# Altium project io test.PrjPcb
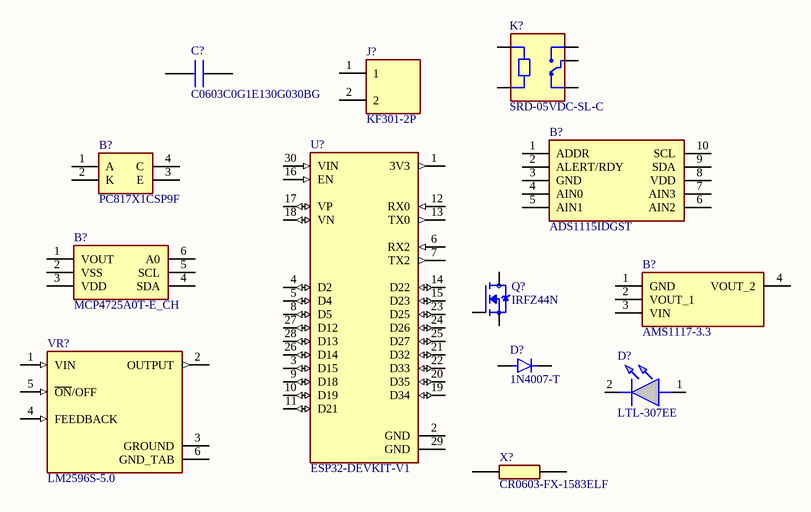
[diagram p0: Sheet1.SchDoc]
1 sheet, 13 parts. Net scope: global (net labels, ports and power ports of the same name join across sheets).
Board file: PCB1.PcbDoc

## Sheet Sheet1.SchDoc
size A3; SheetNumber: 1; SheetTotal: 1

### Parts
(Parts that share a designator on the sheet are numbered #1, #2 ... from top to bottom, then left to right.)
B?#1  ADS1115IDGST  [SOP50P490X110-10N]
B?#2  PC817X1CSP9F  [SOP254P1016X436-4N]
B?#3  MCP4725A0T-E_CH  [SOT95P270X145-6N]
B?#4  AMS1117-3.3  [SOT229P700X180-4N]
C?  C0603C0G1E130G030BG  [CAPC0603X33N]
D?#1  1N4007-T  [DIOAD780W78L463D236]
D?#2  LTL-307EE  [LTL307YE]
J?  KF301-2P  [HANDSON_KF301-2P]
K?  SRD-05VDC-SL-C  [RELAY_SRD-05VDC-SL-C]
Q?  IRFZ44N  [TO254P1016X419X2286-3]
U?  ESP32-DEVKIT-V1  [MODULE_ESP32_DEVKIT_V1]
VR?  LM2596S-5.0  [TO170P1524X483-6N]
X?  CR0603-FX-1583ELF  [RESC1608X55N]

### Nets

Not connected (* = marked no-connect by the designer): B?#1 1(ADDR) 2(ALERT/RDY) 3(GND) 4(AIN0) 5(AIN1) 6(AIN2) 7(AIN3) 8(VDD) 9(SDA) 10(SCL); B?#2 1(A) 2(K) 3(E) 4(C); B?#3 1(VOUT) 2(VSS) 3(VDD) 4(SDA) 5(SCL) 6(A0); B?#4 1(GND) 2(VOUT_1) 3(VIN) 4(VOUT_2); C? 1 2; D?#1 A K; D?#2 1(A) 2(K); J? 1 2; K? A1 A2 COM NC NO; Q? 1(G) 2(D) 3(S); U? 1(3V3) 2(GND) 3(D15) 4(D2) 5(D4) 6(RX2) 7(TX2) 8(D5) 9(D18) 10(D19) 11(D21) 12(RX0) 13(TX0) 14(D22) 15(D23) 16(EN) 17(VP) 18(VN) 19(D34) 20(D35) 21(D32) 22(D33) 23(D25) 24(D26) 25(D27) 26(D14) 27(D12) 28(D13) 29(GND) 30(VIN); VR? 1(VIN) 2(OUTPUT) 3(GROUND) 4(FEEDBACK) 5(~{ON}/OFF) 6(GND_TAB); X? 1 2

### Library data of the parts
B?#1 = ADS1115IDGST: 16-Bit, 860SPS, 4-Ch Delta-Sigma ADC w/ PGA, Oscillator, Voltage Reference, Comparator & I2C; Manufacturer_Name: Texas Instruments; Geometry.Height: 1.1mm; Manufacturer_Part_Number: ADS1115IDGST; Mouser Part Number: 595-ADS1115IDGST; Mouser Price/Stock: https://www.mouser.co.uk/ProductDetail/Texas-Instruments/ADS1115IDGST?qs=6805eV47HhY3JIwOhQ2zog%3D%3D; Arrow Part Number: ADS1115IDGST; Arrow Price/Stock: https://www.arrow.com/en/products/ads1115idgst/texas-instruments?utm_currency=USD&region=nac; Datasheet Link: https://datasheet.datasheetarchive.com/originals/distributors/Datasheets-SFU2/DSASFU100025989.pdf
B?#2 = PC817X1CSP9F: 80V 5kV 50mA 100mV@1mA,20mA 1 6V 1.2V DC SMD-4P Transistor, Photovoltaic Output Optoisolators ROHS; Manufacturer_Name: Sharp Microelectronics; Geometry.Height: 4.36mm; Manufacturer_Part_Number: PC817X1CSP9F; Mouser Part Number: 852-PC817X1CSP9F; Mouser Price/Stock: https://www.mouser.co.uk/ProductDetail/Sharp-Microelectronics/PC817X1CSP9F?qs=rrS6PyfT74f%252BaIhOIosJzQ%3D%3D; Arrow Part Number: *; Arrow Price/Stock: *; Datasheet Link: https://www.lcsc.com/product-detail/Optocouplers-Phototransistor-Output_Sharp-Microelectronics-PC817X1CSP9F_C97308.html
B?#3 = MCP4725A0T-E_CH: D/A Converter 12-Bit EEPROM I2C SOT23-6; Manufacturer_Name: Microchip; Manufacturer_Part_Number: MCP4725A0T-E/CH; Geometry.Height: 1.45mm; Mouser Part Number: 579-MCP4725A0TECH; Mouser Price/Stock: https://www.mouser.co.uk/ProductDetail/Microchip-Technology/MCP4725A0T-E-CH?qs=vkMqrgFpRajeQECZ3goc0A%3D%3D; Arrow Part Number: MCP4725A0T-E/CH; Arrow Price/Stock: https://www.arrow.com/en/products/mcp4725a0t-ech/microchip-technology?utm_currency=USD&region=nac; Datasheet Link: http://ww1.microchip.com/downloads/en/DeviceDoc/22039d.pdf
B?#4 = AMS1117-3.3: 1A LOW DROPOUT VOLTAGE REGULATOR, SOT-223; Manufacturer_Name: Advanced Monolithic Systems; Geometry.Height: 1.8mm; Manufacturer_Part_Number: AMS1117-3.3; Mouser Part Number: *; Mouser Price/Stock: *; Arrow Part Number: *; Arrow Price/Stock: *; Datasheet Link: http://www.advanced-monolithic.com/pdf/ds1117.pdf
C? = C0603C0G1E130G030BG: Multilayer Ceramic Capacitors MLCC - SMD/SMT 0201, 13pF, 25volts C0G, +/-2%; Manufacturer_Name: TDK; Geometry.Height: 0.33mm; Manufacturer_Part_Number: C0603C0G1E130G030BG; Mouser Part Number: 810-C0603C0G1E130GTX; Mouser Price/Stock: http://www.mouser.com/Search/ProductDetail.aspx?qs=dfay7wIA1uG0iMDpXOItSQ%3d%3d; Arrow Part Number: *; Arrow Price/Stock: *; Datasheet Link: https://g.componentsearchengine.com/Datasheets/1/C0603C0G1E130G030BG.pdf
D?#1 = 1N4007-T: Diode, Rectifier, Vr 1000V, If 1A, Pkg DO-41, Vf 1.1V, Cs 30A, Ir 1A | HVCA 1N4007; SnapEDA_Link: https://www.snapeda.com/parts/1N4007/HVCA/view-part/?ref=snap; Package: None; Value: *; MF: HVCA; MP: 1N4007; Check_prices: https://www.snapeda.com/parts/1N4007/HVCA/view-part/?ref=eda
D?#2 = LTL-307EE: Standard LEDs - Through Hole Red Transparent; Manufacturer_Name: Lite-On; Geometry.Height: 9.85mm; Manufacturer_Part_Number: LTL-307EE; Mouser Part Number: 859-LTL-307EE; Mouser Price/Stock: https://www.mouser.co.uk/ProductDetail/Lite-On/LTL-307EE?qs=Yz4wJs0d%252BpgyXm%2FpkMp2pg%3D%3D; Arrow Part Number: LTL-307EE; Arrow Price/Stock: https://www.arrow.com/en/products/ltl-307ee/lite-on-technology?region=nac; Datasheet Link: https://optoelectronics.liteon.com/upload/download/DS-20-92-0161/LTL-307EE.pdf
J? = KF301-2P: 2 Pin Terminal Block 5mm Pitch; MF: Handson Technology; SnapEDA_Link: https://www.snapeda.com/parts/KF301-2P/Handson+Technology/view-part/?ref=snap; Package: None; Value: *; MP: KF301-2P; Check_prices: https://www.snapeda.com/parts/KF301-2P/Handson+Technology/view-part/?ref=eda
K? = SRD-05VDC-SL-C: 5V Trigger Relay Module For Arduino And Raspberry Pi 5V Trigger Relay Module For Arduino And Raspberry Pi; MF: Songle Relay; Check_prices: https://www.snapeda.com/parts/SRD-05VDC-SL-C/Songle+Relay/view-part/?ref=eda; Value: *; Availability: Not in stock; Price: None; Package: NON STANDARD-5 Songle Relay; MP: SRD-05VDC-SL-C; SnapEDA_Link: https://www.snapeda.com/parts/SRD-05VDC-SL-C/Songle+Relay/view-part/?ref=snap
Q? = IRFZ44N: N-Channel 55 V 49A (Tc) 94W (Tc) Through Hole TO-220AB; MF: Infineon Technologies; Check_prices: https://www.snapeda.com/parts/IRFZ44N/Infineon+Technologies/view-part/?ref=eda; Package: TO-220-3 Infineon; MP: IRFZ44N; Value: *; Availability: In Stock; Purchase-URL: https://pricing.snapeda.com/search/part/IRFZ44N/?ref=eda; SnapEDA_Link: https://www.snapeda.com/parts/IRFZ44N/Infineon+Technologies/view-part/?ref=snap; Price: None
U? = ESP32-DEVKIT-V1: Dual core, Wi-Fi: 2.4 GHz up to 150 Mbits/s,BLE (Bluetooth Low Energy) and legacy Bluetooth, 32 bits, Up to 240 MHz; MF: Do it; SnapEDA_Link: https://www.snapeda.com/parts/ESP32-DEVKIT-V1/Do+it/view-part/?ref=snap; Package: None; Value: *; MP: ESP32-DEVKIT-V1; Check_prices: https://www.snapeda.com/parts/ESP32-DEVKIT-V1/Do+it/view-part/?ref=eda
VR? = LM2596S-5.0: SIMPLE SWITCHERÂ® 4.5V to 40V, 3A Low Component Count Step-Down Regulator; MF: Texas Instruments; MP: LM2596S-5.0/NOPB; SnapEDA_Link: https://www.snapeda.com/parts/LM2596S-5.0/NOPB/Texas+Instruments/view-part/?ref=snap; Package: TO-263-5 Texas Instruments; Value: *; Check_prices: https://www.snapeda.com/parts/LM2596S-5.0/NOPB/Texas+Instruments/view-part/?ref=eda
X? = CR0603-FX-1583ELF: Thick Film Resistors - SMD 158K 1% 1/10W; Manufacturer_Name: Bourns; Geometry.Height: 0.55mm; Manufacturer_Part_Number: CR0603-FX-1583ELF; Mouser Part Number: 652-CR0603FX-1583ELF; Mouser Price/Stock: https://www.mouser.com/Search/Refine.aspx?Keyword=652-CR0603FX-1583ELF; Arrow Part Number: *; Arrow Price/Stock: *; Datasheet Link: https://www.bourns.com/pdfs/chpreztr.pdf